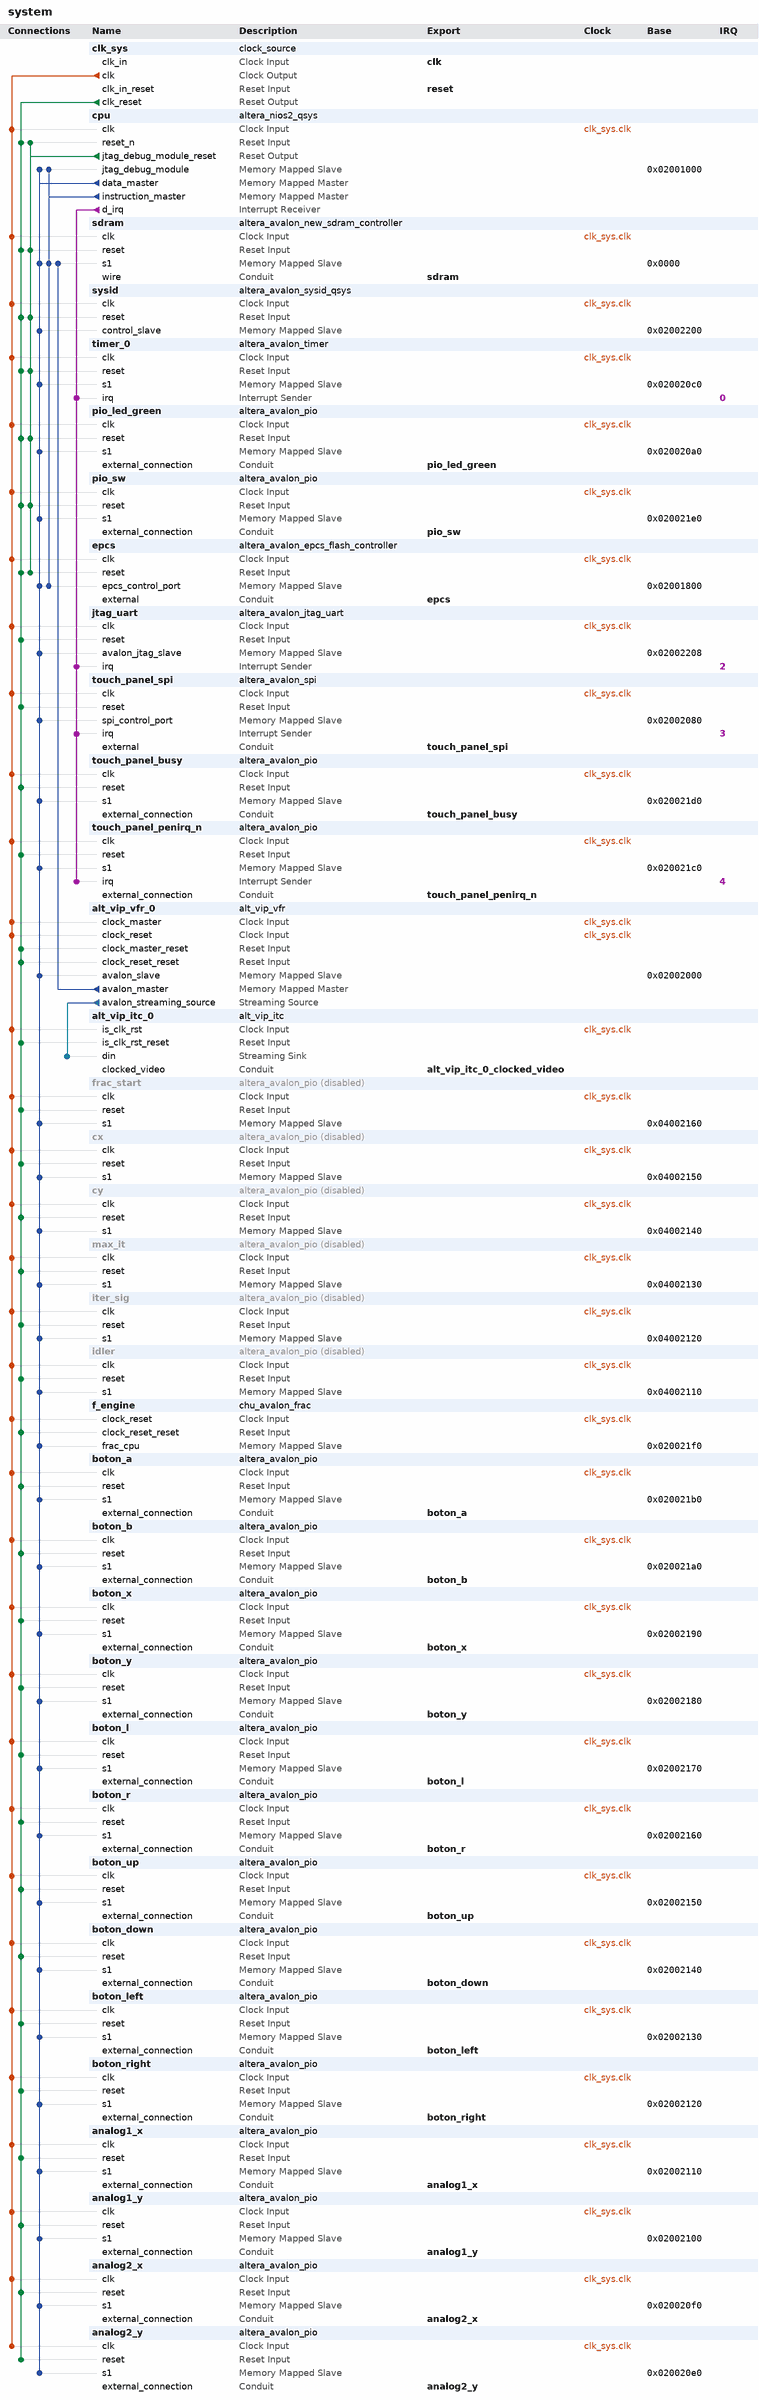
[diagram p0: system contents]
# Platform Designer (Qsys) system system, Cyclone IV E EP4CE22F17C6
# Parameters at their usual value, and those the tool derives, are not listed.
package require -exact qsys 15.0
create_system system
set_project_property DEVICE_FAMILY {Cyclone IV E}
set_project_property DEVICE EP4CE22F17C6

add_instance clk_sys clock_source 15.0
set_instance_parameter_value clk_sys clockFrequency 100000000
set_instance_parameter_value clk_sys resetSynchronousEdges DEASSERT

add_instance cpu altera_nios2_qsys 15.0
set_instance_parameter_value cpu breakSlave cpu.jtag_debug_module
set_instance_parameter_value cpu dcache_lineSize 4
set_instance_parameter_value cpu dcache_size 4096
set_instance_parameter_value cpu exceptionOffset 3840032
set_instance_parameter_value cpu exceptionSlave sdram.s1
set_instance_parameter_value cpu icache_size 8192
set_instance_parameter_value cpu impl Fast
set_instance_parameter_value cpu muldiv_divider true
set_instance_parameter_value cpu resetSlave epcs.epcs_control_port
set_instance_parameter_value cpu resetrequest_enabled true

add_instance sdram altera_avalon_new_sdram_controller 15.0
set_instance_parameter_value sdram TAC 5.5
set_instance_parameter_value sdram TRCD 20.0
set_instance_parameter_value sdram TRP 20.0
set_instance_parameter_value sdram casLatency 3
set_instance_parameter_value sdram columnWidth 9
set_instance_parameter_value sdram dataWidth 16
set_instance_parameter_value sdram generateSimulationModel false
set_instance_parameter_value sdram model custom
set_instance_parameter_value sdram numberOfBanks 4
set_instance_parameter_value sdram numberOfChipSelects 1
set_instance_parameter_value sdram powerUpDelay 100.0
set_instance_parameter_value sdram refreshPeriod 15.625
set_instance_parameter_value sdram rowWidth 13

add_instance sysid altera_avalon_sysid_qsys 15.0
set_instance_parameter_value sysid id 0

add_instance timer_0 altera_avalon_timer 15.0
set_instance_parameter_value timer_0 period 1
set_instance_parameter_value timer_0 periodUnits MSEC

add_instance pio_led_green altera_avalon_pio 15.0
set_instance_parameter_value pio_led_green bitModifyingOutReg true
set_instance_parameter_value pio_led_green direction Output
set_instance_parameter_value pio_led_green width 8

add_instance pio_sw altera_avalon_pio 15.0
set_instance_parameter_value pio_sw direction Input
set_instance_parameter_value pio_sw simDoTestBenchWiring true
set_instance_parameter_value pio_sw width 4

add_instance epcs altera_avalon_epcs_flash_controller 15.0
set_instance_parameter_value epcs resetrequest_enabled true

add_instance jtag_uart altera_avalon_jtag_uart 15.0
set_instance_parameter_value jtag_uart simInteractiveOptions INTERACTIVE_ASCII_OUTPUT

add_instance touch_panel_spi altera_avalon_spi 15.0
set_instance_parameter_value touch_panel_spi clockPolarity 0
set_instance_parameter_value touch_panel_spi dataWidth 8
set_instance_parameter_value touch_panel_spi masterSPI true
set_instance_parameter_value touch_panel_spi numberOfSlaves 1
set_instance_parameter_value touch_panel_spi targetClockRate 32000

add_instance touch_panel_busy altera_avalon_pio 15.0
set_instance_parameter_value touch_panel_busy direction Input
set_instance_parameter_value touch_panel_busy width 1

add_instance touch_panel_penirq_n altera_avalon_pio 15.0
set_instance_parameter_value touch_panel_penirq_n captureEdge true
set_instance_parameter_value touch_panel_penirq_n direction Input
set_instance_parameter_value touch_panel_penirq_n edgeType FALLING
set_instance_parameter_value touch_panel_penirq_n generateIRQ true
set_instance_parameter_value touch_panel_penirq_n irqType EDGE
set_instance_parameter_value touch_panel_penirq_n width 1

add_instance alt_vip_vfr_0 alt_vip_vfr 14.0
set_instance_parameter_value alt_vip_vfr_0 CLOCKS_ARE_SEPARATE 0
set_instance_parameter_value alt_vip_vfr_0 MAX_IMAGE_HEIGHT 600
set_instance_parameter_value alt_vip_vfr_0 MAX_IMAGE_WIDTH 800
set_instance_parameter_value alt_vip_vfr_0 MEM_PORT_WIDTH 32
set_instance_parameter_value alt_vip_vfr_0 NUMBER_OF_CHANNELS_IN_PARALLEL 3

add_instance alt_vip_itc_0 alt_vip_itc 14.0
set_instance_parameter_value alt_vip_itc_0 FIFO_DEPTH 800
set_instance_parameter_value alt_vip_itc_0 H_ACTIVE_PIXELS 800
set_instance_parameter_value alt_vip_itc_0 H_BACK_PORCH 88
set_instance_parameter_value alt_vip_itc_0 H_FRONT_PORCH 40
set_instance_parameter_value alt_vip_itc_0 H_SYNC_LENGTH 128
set_instance_parameter_value alt_vip_itc_0 NUMBER_OF_COLOUR_PLANES 3
set_instance_parameter_value alt_vip_itc_0 THRESHOLD 799
set_instance_parameter_value alt_vip_itc_0 V_ACTIVE_LINES 600
set_instance_parameter_value alt_vip_itc_0 V_BACK_PORCH 23
set_instance_parameter_value alt_vip_itc_0 V_FRONT_PORCH 1
set_instance_parameter_value alt_vip_itc_0 V_SYNC_LENGTH 4

add_instance frac_start altera_avalon_pio 15.0
set_instance_property frac_start ENABLED false
set_instance_parameter_value frac_start direction Output
set_instance_parameter_value frac_start width 1

add_instance cx altera_avalon_pio 15.0
set_instance_property cx ENABLED false
set_instance_parameter_value cx direction Output
set_instance_parameter_value cx width 32

add_instance cy altera_avalon_pio 15.0
set_instance_property cy ENABLED false
set_instance_parameter_value cy direction Output
set_instance_parameter_value cy width 32

add_instance max_it altera_avalon_pio 15.0
set_instance_property max_it ENABLED false
set_instance_parameter_value max_it direction Output
set_instance_parameter_value max_it width 16

add_instance iter_sig altera_avalon_pio 15.0
set_instance_property iter_sig ENABLED false
set_instance_parameter_value iter_sig direction Input
set_instance_parameter_value iter_sig width 16

add_instance idler altera_avalon_pio 15.0
set_instance_property idler ENABLED false
set_instance_parameter_value idler direction Input
set_instance_parameter_value idler width 1

add_instance f_engine chu_avalon_frac 1.0

add_instance boton_a altera_avalon_pio 15.0
set_instance_parameter_value boton_a direction Input
set_instance_parameter_value boton_a width 1

add_instance boton_b altera_avalon_pio 15.0
set_instance_parameter_value boton_b direction Input
set_instance_parameter_value boton_b width 1

add_instance boton_x altera_avalon_pio 15.0
set_instance_parameter_value boton_x direction Input
set_instance_parameter_value boton_x width 1

add_instance boton_y altera_avalon_pio 15.0
set_instance_parameter_value boton_y direction Input
set_instance_parameter_value boton_y width 1

add_instance boton_l altera_avalon_pio 15.0
set_instance_parameter_value boton_l direction Input
set_instance_parameter_value boton_l width 1

add_instance boton_r altera_avalon_pio 15.0
set_instance_parameter_value boton_r direction Input
set_instance_parameter_value boton_r width 1

add_instance boton_up altera_avalon_pio 15.0
set_instance_parameter_value boton_up direction Input
set_instance_parameter_value boton_up width 1

add_instance boton_down altera_avalon_pio 15.0
set_instance_parameter_value boton_down direction Input
set_instance_parameter_value boton_down width 1

add_instance boton_left altera_avalon_pio 15.0
set_instance_parameter_value boton_left direction Input
set_instance_parameter_value boton_left width 1

add_instance boton_right altera_avalon_pio 15.0
set_instance_parameter_value boton_right direction Input
set_instance_parameter_value boton_right width 1

add_instance analog1_x altera_avalon_pio 15.0
set_instance_parameter_value analog1_x direction Input
set_instance_parameter_value analog1_x width 8

add_instance analog1_y altera_avalon_pio 15.0
set_instance_parameter_value analog1_y direction Input
set_instance_parameter_value analog1_y width 8

add_instance analog2_x altera_avalon_pio 15.0
set_instance_parameter_value analog2_x direction Input
set_instance_parameter_value analog2_x width 8

add_instance analog2_y altera_avalon_pio 15.0
set_instance_parameter_value analog2_y direction Input
set_instance_parameter_value analog2_y width 8

# connections
add_connection clk_sys.clk alt_vip_itc_0.is_clk_rst clock
add_connection clk_sys.clk alt_vip_vfr_0.clock_master clock
add_connection clk_sys.clk alt_vip_vfr_0.clock_reset clock
add_connection clk_sys.clk analog1_x.clk clock
add_connection clk_sys.clk analog1_y.clk clock
add_connection clk_sys.clk analog2_x.clk clock
add_connection clk_sys.clk analog2_y.clk clock
add_connection clk_sys.clk boton_a.clk clock
add_connection clk_sys.clk boton_b.clk clock
add_connection clk_sys.clk boton_down.clk clock
add_connection clk_sys.clk boton_l.clk clock
add_connection clk_sys.clk boton_left.clk clock
add_connection clk_sys.clk boton_r.clk clock
add_connection clk_sys.clk boton_right.clk clock
add_connection clk_sys.clk boton_up.clk clock
add_connection clk_sys.clk boton_x.clk clock
add_connection clk_sys.clk boton_y.clk clock
add_connection clk_sys.clk cpu.clk clock
add_connection clk_sys.clk cx.clk clock
add_connection clk_sys.clk cy.clk clock
add_connection clk_sys.clk epcs.clk clock
add_connection clk_sys.clk f_engine.clock_reset clock
add_connection clk_sys.clk frac_start.clk clock
add_connection clk_sys.clk idler.clk clock
add_connection clk_sys.clk iter_sig.clk clock
add_connection clk_sys.clk jtag_uart.clk clock
add_connection clk_sys.clk max_it.clk clock
add_connection clk_sys.clk pio_led_green.clk clock
add_connection clk_sys.clk pio_sw.clk clock
add_connection clk_sys.clk sdram.clk clock
add_connection clk_sys.clk sysid.clk clock
add_connection clk_sys.clk timer_0.clk clock
add_connection clk_sys.clk touch_panel_busy.clk clock
add_connection clk_sys.clk touch_panel_penirq_n.clk clock
add_connection clk_sys.clk touch_panel_spi.clk clock
add_connection clk_sys.clk_reset alt_vip_itc_0.is_clk_rst_reset reset
add_connection clk_sys.clk_reset alt_vip_vfr_0.clock_master_reset reset
add_connection clk_sys.clk_reset alt_vip_vfr_0.clock_reset_reset reset
add_connection clk_sys.clk_reset analog1_x.reset reset
add_connection clk_sys.clk_reset analog1_y.reset reset
add_connection clk_sys.clk_reset analog2_x.reset reset
add_connection clk_sys.clk_reset analog2_y.reset reset
add_connection clk_sys.clk_reset boton_a.reset reset
add_connection clk_sys.clk_reset boton_b.reset reset
add_connection clk_sys.clk_reset boton_down.reset reset
add_connection clk_sys.clk_reset boton_l.reset reset
add_connection clk_sys.clk_reset boton_left.reset reset
add_connection clk_sys.clk_reset boton_r.reset reset
add_connection clk_sys.clk_reset boton_right.reset reset
add_connection clk_sys.clk_reset boton_up.reset reset
add_connection clk_sys.clk_reset boton_x.reset reset
add_connection clk_sys.clk_reset boton_y.reset reset
add_connection clk_sys.clk_reset cpu.reset_n reset
add_connection clk_sys.clk_reset cx.reset reset
add_connection clk_sys.clk_reset cy.reset reset
add_connection clk_sys.clk_reset epcs.reset reset
add_connection clk_sys.clk_reset f_engine.clock_reset_reset reset
add_connection clk_sys.clk_reset frac_start.reset reset
add_connection clk_sys.clk_reset idler.reset reset
add_connection clk_sys.clk_reset iter_sig.reset reset
add_connection clk_sys.clk_reset jtag_uart.reset reset
add_connection clk_sys.clk_reset max_it.reset reset
add_connection clk_sys.clk_reset pio_led_green.reset reset
add_connection clk_sys.clk_reset pio_sw.reset reset
add_connection clk_sys.clk_reset sdram.reset reset
add_connection clk_sys.clk_reset sysid.reset reset
add_connection clk_sys.clk_reset timer_0.reset reset
add_connection clk_sys.clk_reset touch_panel_busy.reset reset
add_connection clk_sys.clk_reset touch_panel_penirq_n.reset reset
add_connection clk_sys.clk_reset touch_panel_spi.reset reset
add_connection cpu.jtag_debug_module_reset cpu.reset_n reset
add_connection cpu.jtag_debug_module_reset epcs.reset reset
add_connection cpu.jtag_debug_module_reset pio_led_green.reset reset
add_connection cpu.jtag_debug_module_reset pio_sw.reset reset
add_connection cpu.jtag_debug_module_reset sdram.reset reset
add_connection cpu.jtag_debug_module_reset sysid.reset reset
add_connection cpu.jtag_debug_module_reset timer_0.reset reset
add_connection alt_vip_vfr_0.avalon_master sdram.s1 avalon
set_connection_parameter_value alt_vip_vfr_0.avalon_master/sdram.s1 baseAddress 0x0000
add_connection cpu.data_master alt_vip_vfr_0.avalon_slave avalon
set_connection_parameter_value cpu.data_master/alt_vip_vfr_0.avalon_slave baseAddress 0x02002000
add_connection cpu.data_master analog1_x.s1 avalon
set_connection_parameter_value cpu.data_master/analog1_x.s1 baseAddress 0x02002110
add_connection cpu.data_master analog1_y.s1 avalon
set_connection_parameter_value cpu.data_master/analog1_y.s1 baseAddress 0x02002100
add_connection cpu.data_master analog2_x.s1 avalon
set_connection_parameter_value cpu.data_master/analog2_x.s1 baseAddress 0x020020f0
add_connection cpu.data_master analog2_y.s1 avalon
set_connection_parameter_value cpu.data_master/analog2_y.s1 baseAddress 0x020020e0
add_connection cpu.data_master boton_a.s1 avalon
set_connection_parameter_value cpu.data_master/boton_a.s1 baseAddress 0x020021b0
add_connection cpu.data_master boton_b.s1 avalon
set_connection_parameter_value cpu.data_master/boton_b.s1 baseAddress 0x020021a0
add_connection cpu.data_master boton_down.s1 avalon
set_connection_parameter_value cpu.data_master/boton_down.s1 baseAddress 0x02002140
add_connection cpu.data_master boton_l.s1 avalon
set_connection_parameter_value cpu.data_master/boton_l.s1 baseAddress 0x02002170
add_connection cpu.data_master boton_left.s1 avalon
set_connection_parameter_value cpu.data_master/boton_left.s1 baseAddress 0x02002130
add_connection cpu.data_master boton_r.s1 avalon
set_connection_parameter_value cpu.data_master/boton_r.s1 baseAddress 0x02002160
add_connection cpu.data_master boton_right.s1 avalon
set_connection_parameter_value cpu.data_master/boton_right.s1 baseAddress 0x02002120
add_connection cpu.data_master boton_up.s1 avalon
set_connection_parameter_value cpu.data_master/boton_up.s1 baseAddress 0x02002150
add_connection cpu.data_master boton_x.s1 avalon
set_connection_parameter_value cpu.data_master/boton_x.s1 baseAddress 0x02002190
add_connection cpu.data_master boton_y.s1 avalon
set_connection_parameter_value cpu.data_master/boton_y.s1 baseAddress 0x02002180
add_connection cpu.data_master cpu.jtag_debug_module avalon
set_connection_parameter_value cpu.data_master/cpu.jtag_debug_module baseAddress 0x02001000
add_connection cpu.data_master cx.s1 avalon
set_connection_parameter_value cpu.data_master/cx.s1 baseAddress 0x04002150
add_connection cpu.data_master cy.s1 avalon
set_connection_parameter_value cpu.data_master/cy.s1 baseAddress 0x04002140
add_connection cpu.data_master epcs.epcs_control_port avalon
set_connection_parameter_value cpu.data_master/epcs.epcs_control_port baseAddress 0x02001800
add_connection cpu.data_master f_engine.frac_cpu avalon
set_connection_parameter_value cpu.data_master/f_engine.frac_cpu baseAddress 0x020021f0
add_connection cpu.data_master frac_start.s1 avalon
set_connection_parameter_value cpu.data_master/frac_start.s1 baseAddress 0x04002160
add_connection cpu.data_master idler.s1 avalon
set_connection_parameter_value cpu.data_master/idler.s1 baseAddress 0x04002110
add_connection cpu.data_master iter_sig.s1 avalon
set_connection_parameter_value cpu.data_master/iter_sig.s1 baseAddress 0x04002120
add_connection cpu.data_master jtag_uart.avalon_jtag_slave avalon
set_connection_parameter_value cpu.data_master/jtag_uart.avalon_jtag_slave baseAddress 0x02002208
add_connection cpu.data_master max_it.s1 avalon
set_connection_parameter_value cpu.data_master/max_it.s1 baseAddress 0x04002130
add_connection cpu.data_master pio_led_green.s1 avalon
set_connection_parameter_value cpu.data_master/pio_led_green.s1 baseAddress 0x020020a0
add_connection cpu.data_master pio_sw.s1 avalon
set_connection_parameter_value cpu.data_master/pio_sw.s1 baseAddress 0x020021e0
add_connection cpu.data_master sdram.s1 avalon
set_connection_parameter_value cpu.data_master/sdram.s1 baseAddress 0x0000
add_connection cpu.data_master sysid.control_slave avalon
set_connection_parameter_value cpu.data_master/sysid.control_slave baseAddress 0x02002200
add_connection cpu.data_master timer_0.s1 avalon
set_connection_parameter_value cpu.data_master/timer_0.s1 baseAddress 0x020020c0
add_connection cpu.data_master touch_panel_busy.s1 avalon
set_connection_parameter_value cpu.data_master/touch_panel_busy.s1 baseAddress 0x020021d0
add_connection cpu.data_master touch_panel_penirq_n.s1 avalon
set_connection_parameter_value cpu.data_master/touch_panel_penirq_n.s1 baseAddress 0x020021c0
add_connection cpu.data_master touch_panel_spi.spi_control_port avalon
set_connection_parameter_value cpu.data_master/touch_panel_spi.spi_control_port baseAddress 0x02002080
add_connection cpu.instruction_master cpu.jtag_debug_module avalon
set_connection_parameter_value cpu.instruction_master/cpu.jtag_debug_module baseAddress 0x02001000
add_connection cpu.instruction_master epcs.epcs_control_port avalon
set_connection_parameter_value cpu.instruction_master/epcs.epcs_control_port baseAddress 0x02001800
add_connection cpu.instruction_master sdram.s1 avalon
set_connection_parameter_value cpu.instruction_master/sdram.s1 baseAddress 0x0000
add_connection alt_vip_vfr_0.avalon_streaming_source alt_vip_itc_0.din avalon_streaming
add_connection cpu.d_irq jtag_uart.irq interrupt
set_connection_parameter_value cpu.d_irq/jtag_uart.irq irqNumber 2
add_connection cpu.d_irq timer_0.irq interrupt
set_connection_parameter_value cpu.d_irq/timer_0.irq irqNumber 0
add_connection cpu.d_irq touch_panel_penirq_n.irq interrupt
set_connection_parameter_value cpu.d_irq/touch_panel_penirq_n.irq irqNumber 4
add_connection cpu.d_irq touch_panel_spi.irq interrupt
set_connection_parameter_value cpu.d_irq/touch_panel_spi.irq irqNumber 3

# exported interfaces
add_interface alt_vip_itc_0_clocked_video conduit end
set_interface_property alt_vip_itc_0_clocked_video EXPORT_OF alt_vip_itc_0.clocked_video
add_interface analog1_x conduit end
set_interface_property analog1_x EXPORT_OF analog1_x.external_connection
add_interface analog1_y conduit end
set_interface_property analog1_y EXPORT_OF analog1_y.external_connection
add_interface analog2_x conduit end
set_interface_property analog2_x EXPORT_OF analog2_x.external_connection
add_interface analog2_y conduit end
set_interface_property analog2_y EXPORT_OF analog2_y.external_connection
add_interface boton_a conduit end
set_interface_property boton_a EXPORT_OF boton_a.external_connection
add_interface boton_b conduit end
set_interface_property boton_b EXPORT_OF boton_b.external_connection
add_interface boton_down conduit end
set_interface_property boton_down EXPORT_OF boton_down.external_connection
add_interface boton_l conduit end
set_interface_property boton_l EXPORT_OF boton_l.external_connection
add_interface boton_left conduit end
set_interface_property boton_left EXPORT_OF boton_left.external_connection
add_interface boton_r conduit end
set_interface_property boton_r EXPORT_OF boton_r.external_connection
add_interface boton_right conduit end
set_interface_property boton_right EXPORT_OF boton_right.external_connection
add_interface boton_up conduit end
set_interface_property boton_up EXPORT_OF boton_up.external_connection
add_interface boton_x conduit end
set_interface_property boton_x EXPORT_OF boton_x.external_connection
add_interface boton_y conduit end
set_interface_property boton_y EXPORT_OF boton_y.external_connection
add_interface clk clock sink
set_interface_property clk EXPORT_OF clk_sys.clk_in
add_interface epcs conduit end
set_interface_property epcs EXPORT_OF epcs.external
add_interface pio_led_green conduit end
set_interface_property pio_led_green EXPORT_OF pio_led_green.external_connection
add_interface pio_sw conduit end
set_interface_property pio_sw EXPORT_OF pio_sw.external_connection
add_interface reset reset sink
set_interface_property reset EXPORT_OF clk_sys.clk_in_reset
add_interface sdram conduit end
set_interface_property sdram EXPORT_OF sdram.wire
add_interface touch_panel_busy conduit end
set_interface_property touch_panel_busy EXPORT_OF touch_panel_busy.external_connection
add_interface touch_panel_penirq_n conduit end
set_interface_property touch_panel_penirq_n EXPORT_OF touch_panel_penirq_n.external_connection
add_interface touch_panel_spi conduit end
set_interface_property touch_panel_spi EXPORT_OF touch_panel_spi.external

set_interconnect_requirement {$system} qsys_mm.clockCrossingAdapter AUTO
set_interconnect_requirement {$system} qsys_mm.maxAdditionalLatency 4

save_system system.qsys
